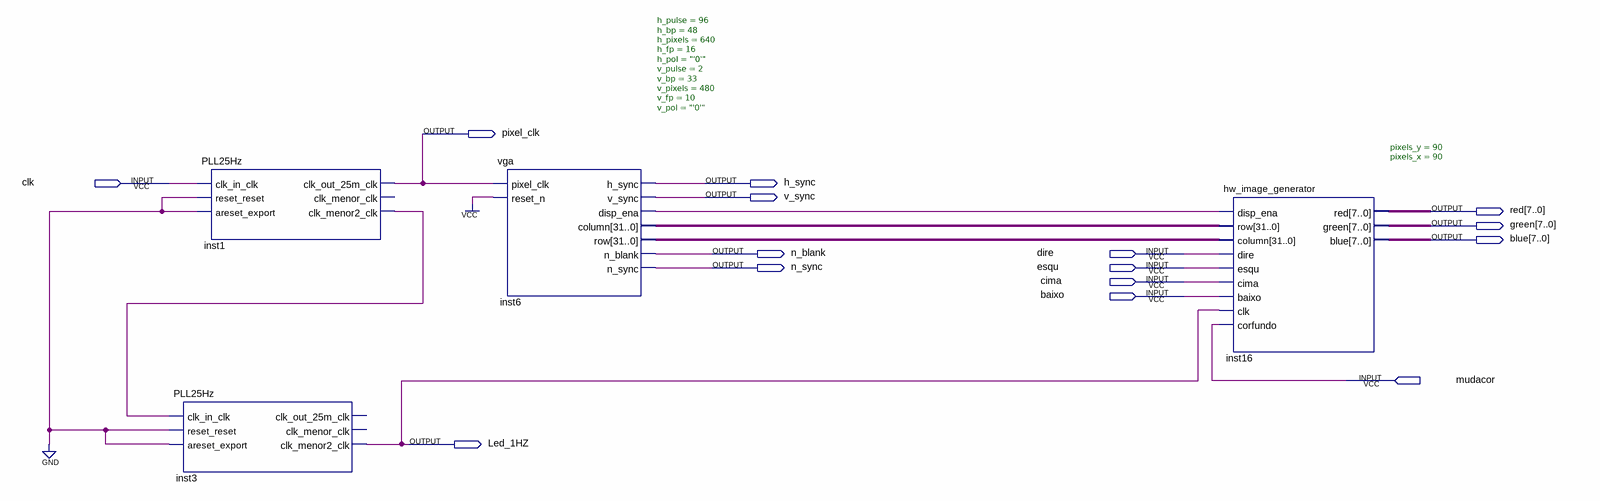
[diagram p0: schematic sheet]
// Quartus schematic VGA_completo.bdf as structural Verilog: 4 symbols, 15 pins
module VGA_completo (
  input  clk,
  input  dire,
  input  esqu,
  input  cima,
  input  baixo,
  input  mudacor,
  output pixel_clk,
  output h_sync,
  output v_sync,
  output [7:0] red,
  output [7:0] green,
  output [7:0] blue,
  output n_blank,
  output n_sync,
  output Led_1HZ
);

  wire inst1_clk_menor2_clk, inst6_disp_ena;
  wire [31:0] inst6_column, inst6_row;

  PLL25Hz inst1 (
    .clk_in_clk(clk), .reset_reset(1'b0), .areset_export(1'b0), .clk_out_25m_clk(pixel_clk),
    .clk_menor2_clk(inst1_clk_menor2_clk));  // open: clk_menor_clk
  PLL25Hz inst3 (
    .clk_in_clk(inst1_clk_menor2_clk), .reset_reset(1'b0), .areset_export(1'b0), .clk_menor2_clk(Led_1HZ));  // open: clk_out_25m_clk, clk_menor_clk
  vga #(.h_pulse(96), .h_bp(48), .h_pixels(640), .h_fp(16), .h_pol("'0'"), .v_pulse(2), .v_bp(33), .v_pixels(480), .v_fp(10), .v_pol("'0'")) inst6 (
    .pixel_clk(pixel_clk), .reset_n(1'b1), .h_sync(h_sync), .v_sync(v_sync), .disp_ena(inst6_disp_ena),
    .column(inst6_column), .row(inst6_row), .n_blank(n_blank), .n_sync(n_sync));
  hw_image_generator #(.pixels_y(90), .pixels_x(90)) inst16 (
    .disp_ena(inst6_disp_ena), .row(inst6_column), .column(inst6_row), .dire(dire), .esqu(esqu), .cima(cima),
    .baixo(baixo), .clk(Led_1HZ), .corfundo(mudacor), .red(red), .green(green), .blue(blue));
endmodule
